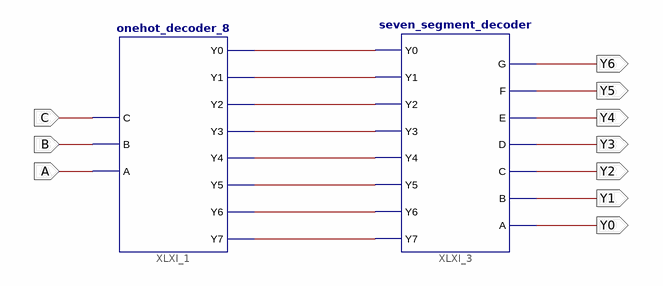
[diagram p0: schematic sheet 1]
// Xilinx ISE schematic binary_to_7seg_decoder.sch (zynq) as structural Verilog: 2 symbols, 10 ports
module binary_to_7seg_decoder (
  input  C,
  input  B,
  input  A,
  output Y0,
  output Y1,
  output Y2,
  output Y3,
  output Y4,
  output Y5,
  output Y6
);

  wire D0, D1, D2, D3, D4, D5, D6, D7;

  onehot_decoder_8 XLXI_1 (.B(B), .Y0(D0), .Y1(D1), .Y2(D2), .Y3(D3), .Y4(D4), .Y5(D5), .Y6(D6), .Y7(D7), .A(A), .C(C));
  seven_segment_decoder XLXI_3 (
    .Y7(D7), .Y6(D6), .Y4(D4), .Y3(D3), .Y2(D2), .Y1(D1), .Y0(D0), .Y5(D5), .A(Y0), .B(Y1), .C(Y2), .D(Y3),
    .E(Y4), .F(Y5), .G(Y6));
endmodule
